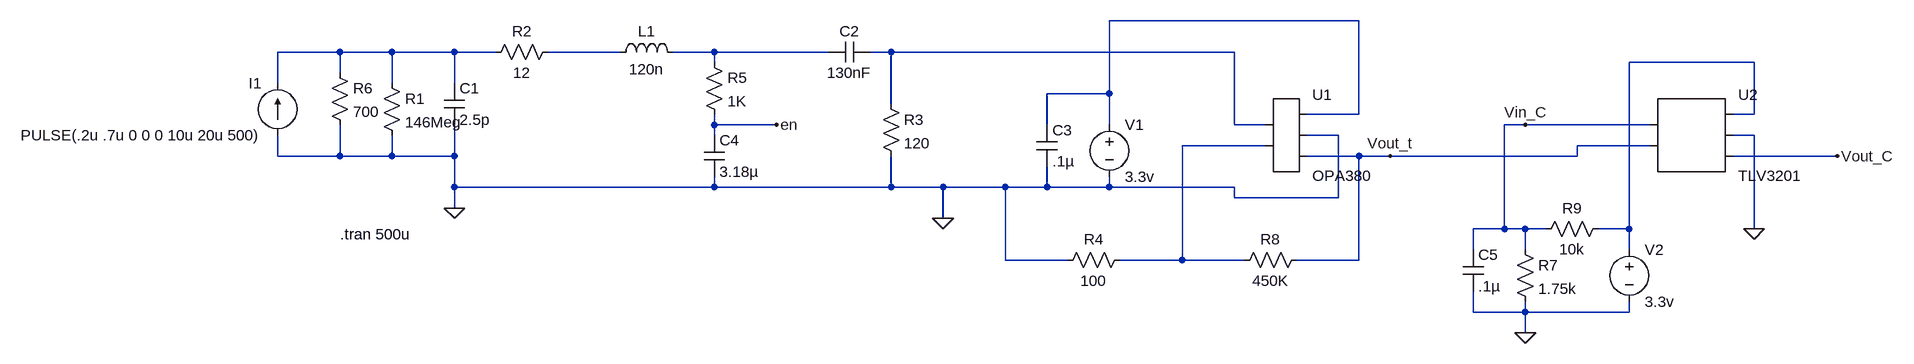
[diagram p0: schematic communication_brunch.asc]
communication_brunch.asc, the LTspice schematic file:
Version 4
SHEET 1 1968 920
WIRE 1136 320 752 320
WIRE -432 368 -528 368
WIRE -352 368 -432 368
WIRE -256 368 -352 368
WIRE -192 368 -256 368
WIRE 0 368 -112 368
WIRE 144 368 80 368
WIRE 320 368 144 368
WIRE 416 368 384 368
WIRE 944 368 416 368
WIRE 144 384 144 368
WIRE 1744 384 1552 384
WIRE -432 400 -432 368
WIRE -528 416 -528 368
WIRE -352 416 -352 368
WIRE -256 416 -256 368
WIRE 752 432 752 320
WIRE 752 432 656 432
WIRE 416 448 416 368
WIRE 1136 464 1136 320
WIRE 1136 464 1056 464
WIRE 1744 464 1744 384
WIRE 1744 464 1712 464
WIRE 144 480 144 464
WIRE 240 480 144 480
WIRE 656 480 656 432
WIRE 752 480 752 432
WIRE 944 480 944 368
WIRE 992 480 944 480
WIRE 1392 480 1360 480
WIRE 1584 480 1392 480
WIRE 144 496 144 480
WIRE 1104 496 1056 496
WIRE 1744 496 1712 496
WIRE 992 512 864 512
WIRE 1584 512 1472 512
WIRE -528 528 -528 496
WIRE -432 528 -432 480
WIRE -432 528 -528 528
WIRE -352 528 -352 496
WIRE -352 528 -432 528
WIRE -256 528 -256 480
WIRE -256 528 -352 528
WIRE 1136 528 1056 528
WIRE 1184 528 1136 528
WIRE 1472 528 1472 512
WIRE 1472 528 1184 528
WIRE 1872 528 1712 528
WIRE -256 576 -256 528
WIRE 144 576 144 560
WIRE 144 576 -256 576
WIRE 416 576 416 528
WIRE 416 576 144 576
WIRE 496 576 416 576
WIRE 592 576 496 576
WIRE 656 576 656 544
WIRE 656 576 592 576
WIRE 752 576 752 560
WIRE 752 576 656 576
WIRE 944 576 752 576
WIRE 944 592 944 576
WIRE 1104 592 1104 496
WIRE 1104 592 944 592
WIRE -256 608 -256 576
WIRE 496 624 496 576
WIRE 1360 640 1360 480
WIRE 1360 640 1312 640
WIRE 1392 640 1360 640
WIRE 1424 640 1392 640
WIRE 1552 640 1552 384
WIRE 1552 640 1504 640
WIRE 1744 640 1744 496
WIRE 1312 672 1312 640
WIRE 1392 672 1392 640
WIRE 1552 672 1552 640
WIRE 592 688 592 576
WIRE 688 688 592 688
WIRE 864 688 864 512
WIRE 864 688 768 688
WIRE 960 688 864 688
WIRE 1136 688 1136 528
WIRE 1136 688 1040 688
WIRE 1312 768 1312 736
WIRE 1392 768 1392 752
WIRE 1392 768 1312 768
WIRE 1552 768 1552 752
WIRE 1552 768 1392 768
WIRE 1392 800 1392 768
FLAG -256 608 0
FLAG 496 624 0
FLAG 240 480 en
FLAG 1744 640 0
FLAG 1392 800 0
FLAG 1872 528 Vout_C
FLAG 1184 528 Vout_t
FLAG 1392 480 Vin_C
SYMBOL res -368 400 R0
SYMATTR InstName R1
SYMATTR Value 146Meg
SYMBOL cap -272 416 R0
SYMATTR InstName C1
SYMATTR Value 2.5p
SYMBOL res -96 352 R90
WINDOW 0 0 56 VBottom 2
WINDOW 3 32 56 VTop 2
SYMATTR InstName R2
SYMATTR Value 12
SYMBOL current -528 496 R180
WINDOW 3 24 0 Left 2
WINDOW 0 24 80 Left 2
SYMATTR Value PULSE(.2u .7u 0 0 0 10u 20u 500)
SYMATTR InstName I1
SYMATTR Value2 AC .5u 0
SYMBOL Cap 384 352 R90
WINDOW 0 0 32 VBottom 2
WINDOW 3 32 32 VTop 2
SYMATTR InstName C2
SYMATTR Value 130nF
SYMBOL ind -16 384 R270
WINDOW 0 32 56 VTop 2
WINDOW 3 5 56 VBottom 2
SYMATTR InstName L1
SYMATTR Value 120n
SYMBOL Res 400 432 R0
SYMATTR InstName R3
SYMATTR Value 120
SYMBOL voltage 752 464 R0
SYMATTR InstName V1
SYMATTR Value 3.3v
SYMBOL AutoGenerated/OPA380 1024 496 R0
SYMATTR InstName U1
SYMBOL Res 128 368 R0
SYMATTR InstName R5
SYMATTR Value 1K
SYMBOL Cap 128 496 R0
SYMATTR InstName C4
SYMATTR Value 3.18µ
SYMBOL Res -448 384 R0
SYMATTR InstName R6
SYMATTR Value 700
SYMBOL Res 1056 672 R90
WINDOW 0 0 56 VBottom 2
WINDOW 3 32 56 VTop 2
SYMATTR InstName R8
SYMATTR Value 450K
SYMBOL Cap 640 480 R0
SYMATTR InstName C3
SYMATTR Value .1µ
SYMBOL Res 784 672 R90
WINDOW 0 0 56 VBottom 2
WINDOW 3 32 56 VTop 2
SYMATTR InstName R4
SYMATTR Value 100
SYMBOL AutoGenerated/TLV3201 1648 496 R0
SYMATTR InstName U2
SYMBOL Cap 1296 672 R0
SYMATTR InstName C5
SYMATTR Value .1µ
SYMBOL Res 1376 656 R0
SYMATTR InstName R7
SYMATTR Value 1.75k
SYMBOL Voltage 1552 656 R0
SYMATTR InstName V2
SYMATTR Value 3.3v
SYMBOL Res 1520 624 R90
WINDOW 0 0 56 VBottom 2
WINDOW 3 32 56 VTop 2
SYMATTR InstName R9
SYMATTR Value 10k
TEXT -432 648 Left 2 !.tran 500u

The netlist it stands for:
* communication_brunch.asc
R1 N002 0 146Meg
C1 N002 0 2.5p
R2 N003 N002 12
I1 0 N002 PULSE(.2u .7u 0 0 0 10u 20u 500) AC .5u 0
C2 N005 N004 130nF
L1 N003 N004 120n
R3 N005 0 120
V1 N001 0 3.3v
* U1: OPA380 (symbol AutoGenerated/OPA380 not available, pins judged from their places): pin1=N005 pin2=N007 pin3=N001 pin4=0 pin5=Vout_t
R5 N004 en 1K
C4 en 0 3.18µ
R6 N002 0 700
R8 Vout_t N007 450K
C3 N001 0 .1µ
R4 N007 0 100
* U2: TLV3201 (symbol AutoGenerated/TLV3201 not available, pins judged from their places): pin1=Vin_C pin2=Vout_t pin3=N006 pin4=0 pin5=Vout_C
C5 Vin_C 0 .1µ
R7 Vin_C 0 1.75k
V2 N006 0 3.3v
R9 N006 Vin_C 10k
.tran 500u
.backanno
.end